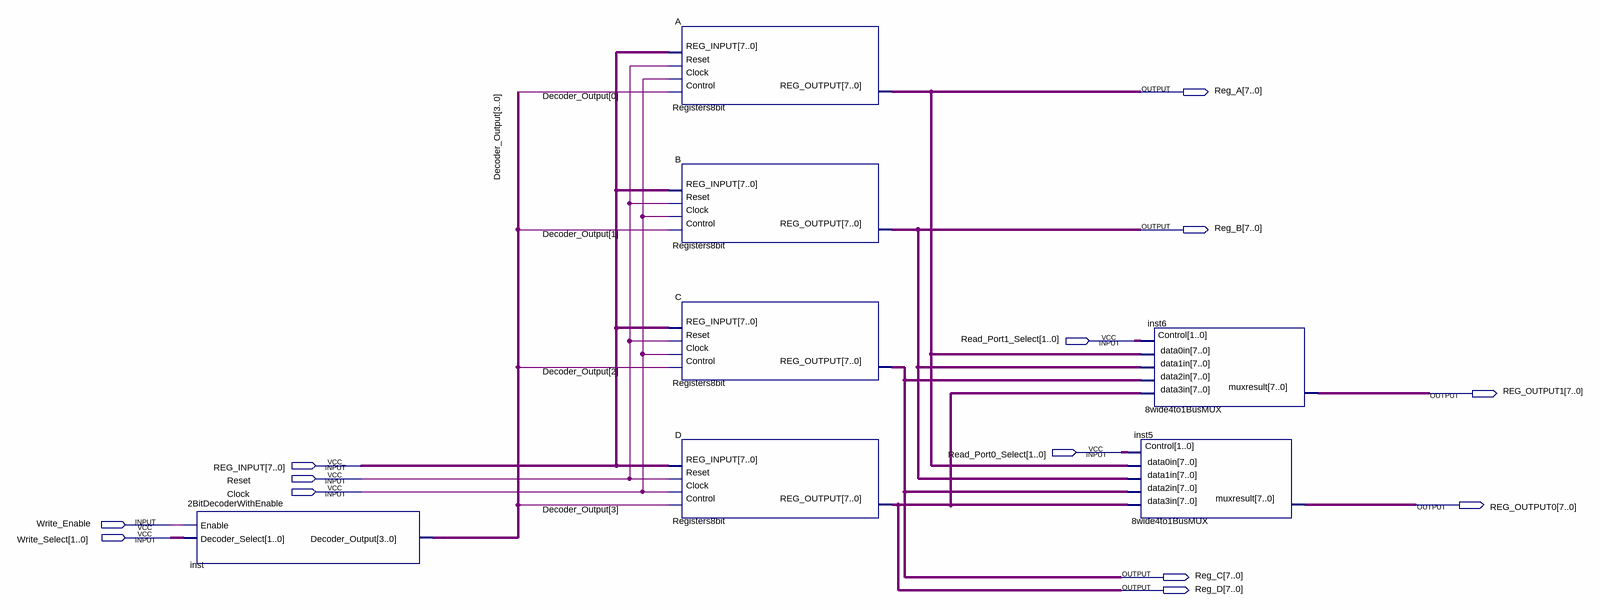
[diagram p0: schematic sheet]
// Quartus schematic 4x8BitRegisters.bdf as structural Verilog: 7 symbols, 13 pins
module \4x8BitRegisters  (
  input  [1:0] Read_Port1_Select,
  input  [1:0] Read_Port0_Select,
  input  [7:0] REG_INPUT,
  input  Reset,
  input  Clock,
  input  Write_Enable,
  input  [1:0] Write_Select,
  output [7:0] Reg_A,
  output [7:0] Reg_B,
  output [7:0] REG_OUTPUT1,
  output [7:0] REG_OUTPUT0,
  output [7:0] Reg_C,
  output [7:0] Reg_D
);

  wire [3:0] Decoder_Output;

  \2BitDecoderWithEnable  inst (.Enable(Write_Enable), .Decoder_Select(Write_Select), .Decoder_Output(Decoder_Output));
  Registers8bit A (
    .Control(Decoder_Output[0]), .Clock(Clock), .Reset(Reset), .REG_INPUT(REG_INPUT), .REG_OUTPUT(Reg_A));
  Registers8bit B (
    .Control(Decoder_Output[1]), .Clock(Clock), .Reset(Reset), .REG_INPUT(REG_INPUT), .REG_OUTPUT(Reg_B));
  Registers8bit C (
    .Control(Decoder_Output[2]), .Clock(Clock), .Reset(Reset), .REG_INPUT(REG_INPUT), .REG_OUTPUT(Reg_C));
  Registers8bit D (
    .Control(Decoder_Output[3]), .Clock(Clock), .Reset(Reset), .REG_INPUT(REG_INPUT), .REG_OUTPUT(Reg_D));
  \8wide4to1BusMUX  inst6 (
    .data0in(Reg_A), .data1in(Reg_B), .data2in(Reg_C), .data3in(Reg_D), .Control(Read_Port1_Select),
    .muxresult(REG_OUTPUT1));
  \8wide4to1BusMUX  inst5 (
    .data0in(Reg_A), .data1in(Reg_B), .data2in(Reg_C), .data3in(Reg_D), .Control(Read_Port0_Select),
    .muxresult(REG_OUTPUT0));
endmodule
